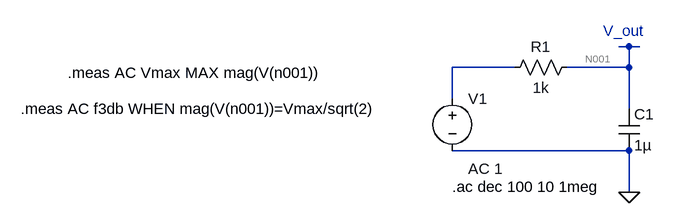
[diagram p0: schematic AC Sweep and frequency response.asc]
AC Sweep and frequency response.asc, the LTspice schematic file:
Version 4.1
SHEET 1 880 680
WIRE 320 112 304 112
WIRE 336 112 320 112
WIRE 144 144 48 144
WIRE 320 144 320 112
WIRE 320 144 224 144
WIRE 48 192 48 144
WIRE 320 208 320 144
WIRE 320 272 48 272
WIRE 320 336 320 272
FLAG 320 336 0
SYMBOL voltage 48 176 R0
WINDOW 123 24 124 Left 2
WINDOW 39 0 0 Left 0
SYMATTR InstName V1
SYMATTR Value ""
SYMATTR Value2 AC 1
SYMBOL res 240 128 R90
WINDOW 0 0 56 VBottom 2
WINDOW 3 32 56 VTop 2
SYMATTR InstName R1
SYMATTR Value 1k
SYMBOL cap 304 208 R0
SYMATTR InstName C1
SYMATTR Value 1µ
TEXT 280 88 Left 2 ;V_out
TEXT 48 328 Left 2 !.ac dec 100 10 1meg
TEXT -544 152 Left 2 !.meas AC Vmax MAX mag(V(n001))
TEXT -616 208 Left 2 !.meas AC f3db WHEN mag(V(n001))=Vmax/sqrt(2)

The netlist it stands for:
* AC Sweep and frequency response.asc
V1 N002 0 AC 1
R1 N001 N002 1k
C1 N001 0 1µ
* V_out
.ac dec 100 10 1meg
.meas AC Vmax MAX mag(V(n001))
.meas AC f3db WHEN mag(V(n001))=Vmax/sqrt(2)
.backanno
.end